# Altium schematic sheet Microphone and Speaker.SchDoc
size Legal; SheetNumber: 10; SheetTotal: 10
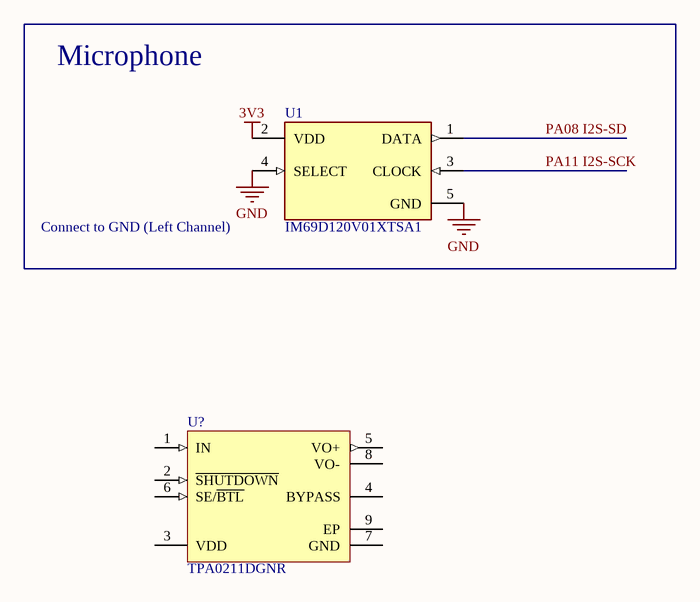
[diagram p0: Microphone and Speaker.SchDoc]

## Parts
U1  IM69D120V01XTSA1  [FP-PG-LLGA-5-MFG]
U?  TPA0211DGNR  [DGN0008D_N]

## Nets
3V3: U1.2(VDD)
GND: U1.4(SELECT) U1.5(GND)
PA08 I2S-SD: U1.1(DATA)
PA11 I2S-SCK: U1.3(CLOCK)

Not connected (* = marked no-connect by the designer): U? 1(IN) 2(~{SHUTDOWN}) 3(VDD) 4(BYPASS) 5(VO+) 6(SE/~{BTL}) 7(GND) 8(VO-) 9(EP)

## Notes on the sheet
- Microphone
- (near U1) Connect to GND (Left Channel)
- Title:
- Desc:
- Size:
- Letter
- Auth:
- Proj:
- Sheet
- of
- www.seas.upenn.edu
- Electrical and Systems Engineering

## Library data of the parts
U1 = CMP-32873-000001-1: MIC MEMS DIGITAL OMNI 105DB; Manufacturer: Infineon; Operating Supply Current: 300-980uA; Sensor Output: Other; Min Supply Voltage: 1.62V; Max Supply Voltage: 3.6V; Height: 1.3mm; ComponentLink2URL: https://www.infineon.com/dgdl/Infineon-IM69D120-DS-v01_00-EN.pdf?fileId=5546d462602a9dc801607a0e41a01a2b; Ambient Temperature Range High: +70°C; Device Class L3: unset; Device Class L1: Sensors; Octopart: https://octopart.com/im69d120v01xtsa1-infineon-88210679; Lead Free: Yes; ComponentLink2Description: Datasheet; RoHS: TRUE; Automotive: No; Category: IC; Device Class L2: unset; Mouser Description: High Performance Digital XENSIV MEMS Microphone Omnidirectional -26dBFS 1.62 to 3.6V 5-Pin T/R; Manufacturer Part Number: IM69D120V01XTSA1; Digikey Description: MIC MEMS DIGITAL OMNI 105DB; Package: PG-LLGA-5; Ambient Temperature Range Low: -40°C
U? = CMP-0991-00066-2: Mono Class-AB Audio Amplifier with Mono Headphone Drive, -40 to 85 degC, 8-pin SOP (DGN8), Green (RoHS & no Sb/Br); Manufacturer: Texas Instruments; Output Power(W): 2; SubFamily: Dynamic Speaker; PSRR(dB): 58; Supply Min(Min)(Volt): 2.5; Supply Max(Max)(Volt): 5.5; ComponentLink3URL: http://www.ti.com/litv/pdf/mpds046e; PartNumber: TPA0211DGNR; Speaker Channels: Mono; DatasheetVersion: SLOS275D; ComponentLink1URL: http://www.ti.com/; Eco-Plan: Green (RoHS & no Sb/Br); Headphone Channels: Mono; Code_JEDEC: MO-187; PackageDescription: 8-Pin Plastic Small Outline, Body 3 x 3 mm, Pitch 0.65 mm; ComponentLink1Description: Manufacturer URL; ComponentLink2Description: Datasheet; ComponentLink3Description: Package Specification; ComponentLink2URL: http://www.ti.com/general/docs/lit/getliterature.tsp?genericPartNumber=TPA0211&fileType=pdf; Speaker Amp Type: Class-AB; PackageReference: DGN0008D; PackageVersion: 4073271/F, 05/2011; Mounting Technology: Surface Mount